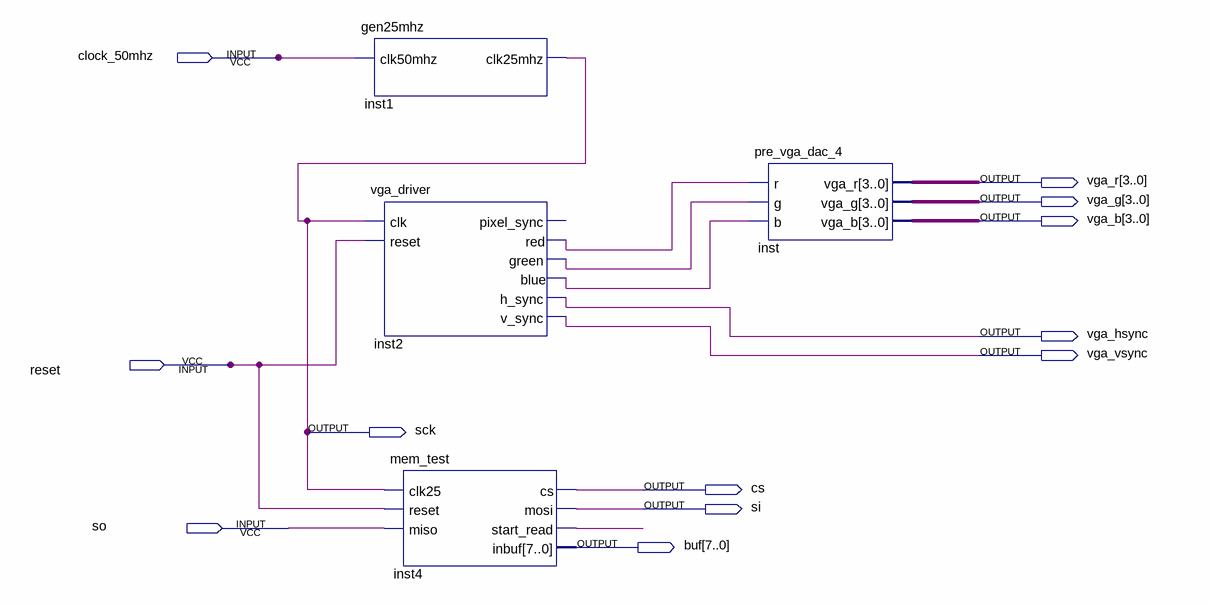
[diagram p0: schematic sheet]
// Quartus schematic top_de1.bdf as structural Verilog: 4 symbols, 12 pins
module top_de1 (
  input  clock_50mhz,
  input  reset,
  input  so,
  output [3:0] vga_r,
  output [3:0] vga_g,
  output [3:0] vga_b,
  output vga_hsync,
  output vga_vsync,
  output sck,
  output cs,
  output si,
  output [7:0] \buf 
);

  wire inst2_blue, inst2_green, inst2_red, inst4_start_read;

  gen25mhz inst1 (.clk50mhz(clock_50mhz), .clk25mhz(sck));
  vga_driver inst2 (
    .clk(sck), .reset(reset), .red(inst2_red), .green(inst2_green), .blue(inst2_blue), .h_sync(vga_hsync),
    .v_sync(vga_vsync));  // open: pixel_sync
  mem_test inst4 (
    .clk25(sck), .reset(reset), .miso(so), .cs(cs), .mosi(si), .start_read(inst4_start_read), .inbuf(\buf ));
  pre_vga_dac_4 inst (.r(inst2_red), .g(inst2_green), .b(inst2_blue), .vga_r(vga_r), .vga_g(vga_g), .vga_b(vga_b));
endmodule
